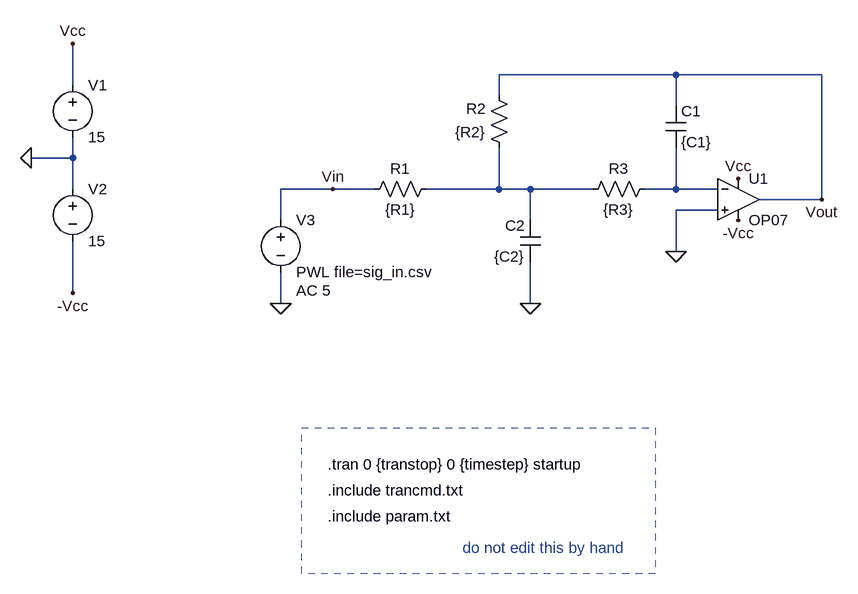
[diagram p0: schematic A7_BajaMFF_2.asc]
A7_BajaMFF_2.asc, the LTspice schematic file:
Version 4
SHEET 1 1284 680
WIRE 192 -272 -80 -272
WIRE 416 -272 192 -272
WIRE -736 -256 -736 -320
WIRE -80 -240 -80 -272
WIRE 192 -224 192 -272
WIRE -736 -144 -736 -176
WIRE -736 -144 -800 -144
WIRE -736 -96 -736 -144
WIRE -336 -96 -416 -96
WIRE -272 -96 -336 -96
WIRE -80 -96 -80 -160
WIRE -80 -96 -192 -96
WIRE -32 -96 -80 -96
WIRE 64 -96 -32 -96
WIRE 192 -96 192 -160
WIRE 192 -96 144 -96
WIRE 256 -96 192 -96
WIRE 416 -80 416 -272
WIRE 416 -80 320 -80
WIRE 256 -64 192 -64
WIRE -416 -48 -416 -96
WIRE -32 -48 -32 -96
WIRE 192 0 192 -64
WIRE -736 64 -736 -16
WIRE -416 80 -416 32
WIRE -32 80 -32 16
FLAG -336 -96 Vin
FLAG -800 -144 0
FLAG -736 -320 Vcc
FLAG -736 64 -Vcc
FLAG -416 80 0
FLAG -32 80 0
FLAG 288 -112 Vcc
FLAG 288 -48 -Vcc
FLAG 416 -80 Vout
FLAG 192 0 0
SYMBOL res -176 -112 R90
WINDOW 0 0 56 VBottom 2
WINDOW 3 32 56 VTop 2
SYMATTR InstName R1
SYMATTR Value {R1}
SYMBOL cap 176 -224 R0
SYMATTR InstName C1
SYMATTR Value {C1}
SYMBOL OpAmps\\OP07 288 -144 R0
SYMATTR InstName U1
SYMBOL cap -16 16 R180
WINDOW 0 24 56 Left 2
WINDOW 3 24 8 Left 2
SYMATTR InstName C2
SYMATTR Value {C2}
SYMBOL voltage -736 -272 R0
WINDOW 123 0 0 Left 0
WINDOW 39 0 0 Left 0
SYMATTR InstName V1
SYMATTR Value 15
SYMBOL voltage -736 -112 R0
WINDOW 123 0 0 Left 0
WINDOW 39 0 0 Left 0
SYMATTR InstName V2
SYMATTR Value 15
SYMBOL voltage -416 -64 R0
WINDOW 123 24 124 Left 2
WINDOW 39 0 0 Left 0
SYMATTR Value2 AC 5
SYMATTR InstName V3
SYMATTR Value PWL file=sig_in.csv
SYMBOL res -64 -144 R180
WINDOW 0 36 76 Left 2
WINDOW 3 36 40 Left 2
SYMATTR InstName R2
SYMATTR Value {R2}
SYMBOL res 48 -80 R270
WINDOW 0 32 56 VTop 2
WINDOW 3 0 56 VBottom 2
SYMATTR InstName R3
SYMATTR Value {R3}
TEXT -344 328 Left 2 !.tran 0 {transtop} 0 {timestep} startup
TEXT -344 408 Left 2 !.include param.txt
TEXT -344 368 Left 2 !.include trancmd.txt
TEXT -136 456 Left 2 ;do not edit this by hand
RECTANGLE Normal 160 496 -384 272 2

The netlist it stands for:
* A7_BajaMFF_2.asc
R1 N001 Vin {R1}
C1 Vout N002 {C1}
XU1 0 N002 Vcc -Vcc Vout LT1001  ; OP07, pins In+ In- V+ V- OUT
C2 0 N001 {C2}
V1 Vcc 0 15
V2 0 -Vcc 15
V3 Vin 0 PWL file=sig_in.csv AC 5
R2 N001 Vout {R2}
R3 N001 N002 {R3}
.tran 0 {transtop} 0 {timestep} startup
.include param.txt
.include trancmd.txt
* do not edit this by hand
.lib LTC.lib
.backanno
.end

* Results of the author's LTspice run, read from the files saved beside the schematic
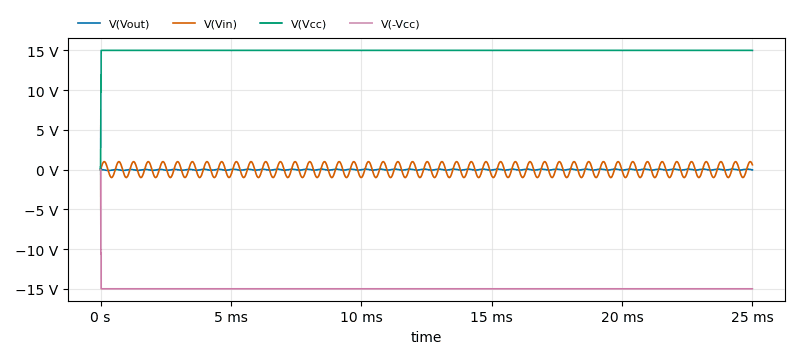
[diagram p1: Transient Analysis of A7_BajaMFF_2.asc, plotted from the saved traces]
* Transient Analysis, 1 run:
*   V(Vout): min -114.6 mV, max 380.7 mV, average -8.632 mV, rms 44.73 mV, last -35.45 mV
*   V(Vin): min -1 V, max 1 V, average 6.429 mV, rms 707.2 mV, last 606.6 mV
*   V(Vcc): min 0 V, max 15 V, average 14.99 V, rms 15 V, last 15 V
*   V(-Vcc): min -15 V, max 0 V, average -14.99 V, rms 15 V, last -15 V